# EAGLE design usb2ax_v4.0 (EAGLE 7.2.0)
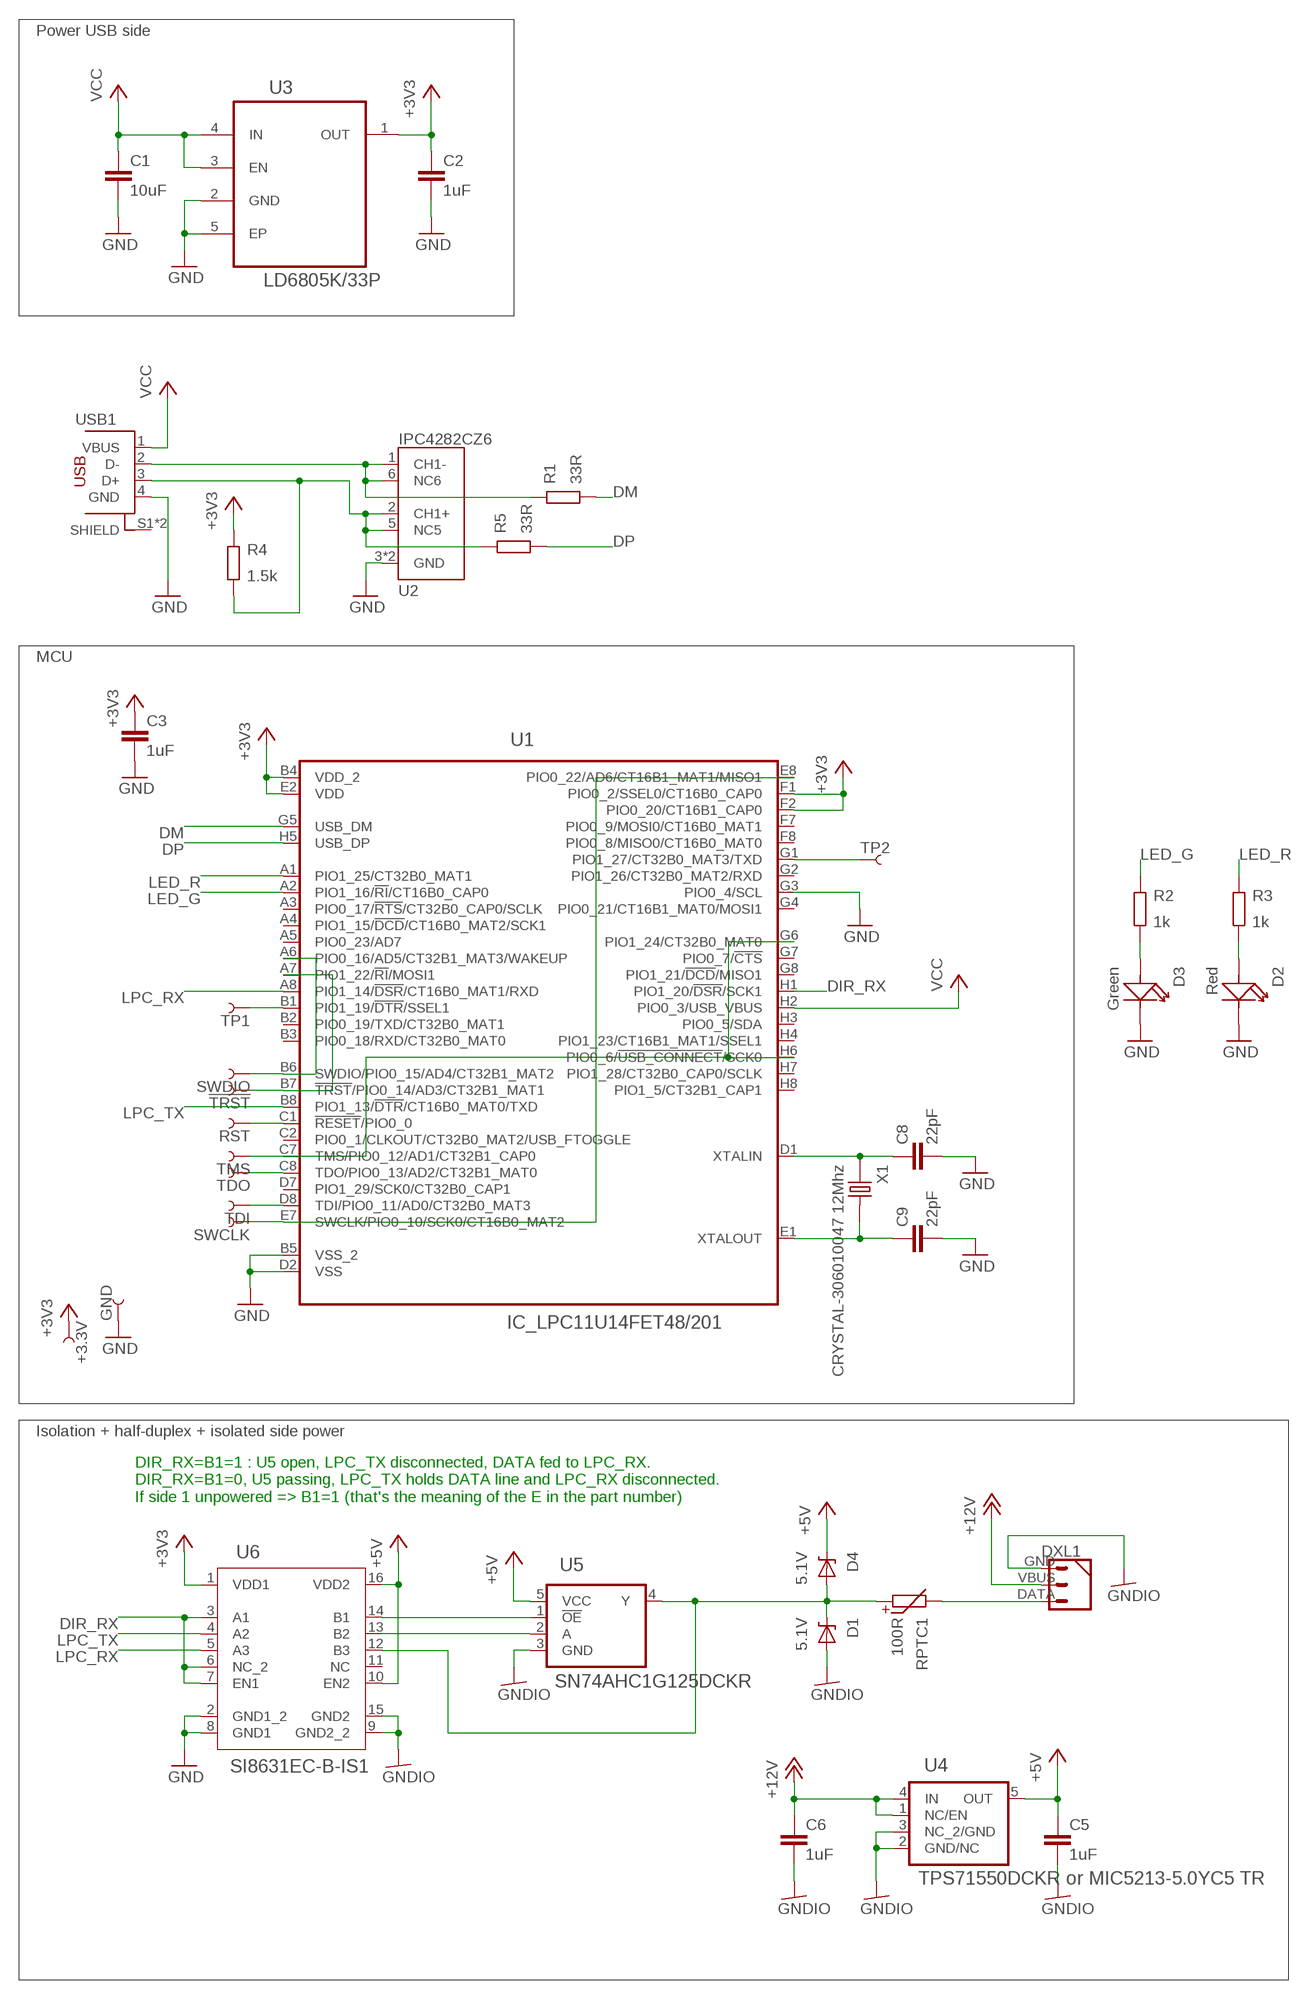
[diagram p0: schematic, sheet 1]

## Parts
!TRST  PIN_SMD_1X1  [PIN_SMD_1X1]
+3.3V  PIN_SMD_1X1  [PIN_SMD_1X1]
C1  10uF  C0805_L  [0805_L]
C2  1uF  C0402  [0402_N]
C3  1uF  C0402  [0402_N]
C5  1uF  C0402  [0402_N]
C6  1uF  C0402  [0402_N]
C8  22pF  C0402  [0402_N]
C9  22pF  C0402  [0402_N]
D1  5.1V  DIODE_ZENER-923  [SOD-923_N]
D2  Red  LED  [LED0603]
D3  Green  LED  [LED0603]
D4  5.1V  DIODE_ZENER-923  [SOD-923_N]
DXL1  DYNAMIXEL_3POS-R  [DYNAMIXEL_3POS_RIGHT]
GND  PIN_SMD_1X1  [PIN_SMD_1X1]
R1  33R  R0201  [0201_N]
R2  1k  R0201  [0201_N]
R3  1k  R0201  [0201_N]
R4  1.5k  R0201  [0201_N]
R5  33R  R0201  [0201_N]
RPTC1  100R  R-PTC0603  [0603_N]
RST  PIN_SMD_1X1  [PIN_SMD_1X1]
SWCLK  PIN_SMD_1X1  [PIN_SMD_1X1]
SWDIO  PIN_SMD_1X1  [PIN_SMD_1X1]
TDI  PIN_SMD_1X1  [PIN_SMD_1X1]
TDO  PIN_SMD_1X1  [PIN_SMD_1X1]
TMS  PIN_SMD_1X1  [PIN_SMD_1X1]
TP1  PIN_SMD_1X1  [PIN_SMD_1X1]
TP2  PIN_SMD_1X1  [PIN_SMD_1X1]
U1  IC_LPC11U14FET48/201  [BGA48C50P8X8_460X460X110]
U2  IPC4282CZ6  [XSON6_N]
U3  LD6805K/33P  [NXP_LD6805]
U4  TPS71550DCKR or MIC5213-5.0YC5 TR  TPS71550DCKR  [SOT65P210X110-5N]
U5  SN74AHC1G125DCKR  [SOT65P210X110-5N]
U6  SI8631EC-B-IS1  SI8631BC-B-IS1  [SOIC-16]
USB1  USB-STANDARD-PLUG_A_THT  [USB-A-THT]
X1  CRYSTAL-306010047 12Mhz  CRYSTAL-0500290P1  [2P-SMD-5.0X3.2]

## Nets
!TRST: !TRST.P$1 U1.A7(PIO1_22/!RI!/MOSI1) U1.B7(!TRST!/PIO0_14/AD3/CT32B1_MAT1)
+3V3: +3.3V.P$1 C2.1 C3.1 R4.2 U1.B4(VDD_2) U1.E2(VDD) U1.F1(PIO0_2/SSEL0/CT16B0_CAP0) U1.F2(PIO0_20/CT16B1_CAP0) U3.1(OUT) U6.1(VDD1)
+5V: C5.1 D4.C U4.5(OUT) U5.5(VCC) U6.10(EN2) U6.16(VDD2)
+12V: C6.1 DXL1.VBUS U4.1(NC/EN) U4.4(IN)
DIR_RX: U1.H1(PIO1_20/!DSR!/SCK1) U6.3(A1) U6.6(NC_2) U6.7(EN1)
DM: R1.1 U1.G5(USB_DM)
DP: R5.1 U1.H5(USB_DP)
GND: C1.2 C2.2 C3.2 C8.2 C9.2 D2.- D3.- GND.P$1 U1.B5(VSS_2) U1.D2(VSS) U1.G3(PIO0_4/SCL) U2.3(GND) U2.4(GND) U3.2(GND) U3.5(EP) U6.2(GND1_2) U6.8(GND1) USB1.4(GND)
GNDIO: C5.2 C6.2 D1.A DXL1.GND U4.2(GND/NC) U4.3(NC_2/GND) U5.3(GND) U6.9(GND2_2) U6.15(GND2)
LED_G: R2.2 U1.A2(PIO1_16/!RI!/CT16B0_CAP0)
LED_R: R3.2 U1.A1(PIO1_25/CT32B0_MAT1)
LPC_RX: U1.A8(PIO1_14/!DSR!/CT16B0_MAT1/RXD) U6.5(A3)
LPC_TX: U1.B8(PIO1_13/!DTR!/CT16B0_MAT0/TXD) U6.4(A2)
N$1: TP1.P$1 U1.B1(PIO1_19/!DTR!/SSEL1)
N$2: D3.+ R2.1
N$3: U5.2(A) U6.13(B2)
N$4: D1.C D4.A RPTC1.1 U5.4(Y) U6.12(B3)
N$5: TP2.P$1 U1.G1(PIO1_27/CT32B0_MAT3/TXD)
N$6: DXL1.DATA RPTC1.2
N$7: C9.1 U1.E1(XTALOUT) X1.2
N$8: C8.1 U1.D1(XTALIN) X1.1
N$9: D2.+ R3.1
N$11: R1.2 U2.1(CH1-) U2.6(NC6) USB1.2(D-)
N$12: R4.1 R5.2 U2.2(CH1+) U2.5(NC5) USB1.3(D+)
N$24: U5.1(!OE) U6.14(B1)
RST: RST.P$1 U1.C1(!RESET!/PIO0_0)
SWCLK: SWCLK.P$1 U1.E7(SWCLK/PIO0_10/SCK0/CT16B0_MAT2) U1.E8(PIO0_22/AD6/CT16B1_MAT1/MISO1)
SWDIO: SWDIO.P$1 U1.A6(PIO0_16/AD5/CT32B1_MAT3/WAKEUP) U1.B6(SWDIO/PIO0_15/AD4/CT32B1_MAT2)
TDI: TDI.P$1 U1.D8(TDI/PIO0_11/AD0/CT32B0_MAT3)
TDO: TDO.P$1 U1.C8(TDO/PIO0_13/AD2/CT32B1_MAT0)
TMS: TMS.P$1 U1.C7(TMS/PIO0_12/AD1/CT32B1_CAP0) U1.G6(PIO1_24/CT32B0_MAT0) U1.H6(PIO0_6/!USB_CONNECT!/SCK0)
VCC: C1.1 U1.H2(PIO0_3/USB_VBUS) U3.3(EN) U3.4(IN) USB1.1(VBUS)
Unconnected: U1.A3(PIO0_17/!RTS!/CT32B0_CAP0/SCLK) U1.A4(PIO1_15/!DCD!/CT16B0_MAT2/SCK1) U1.A5(PIO0_23/AD7) U1.B2(PIO0_19/TXD/CT32B0_MAT1) U1.B3(PIO0_18/RXD/CT32B0_MAT0) U1.C2(PIO0_1/CLKOUT/CT32B0_MAT2/USB_FTOGGLE) U1.D7(PIO1_29/SCK0/CT32B0_CAP1) U1.F7(PIO0_9/MOSI0/CT16B0_MAT1) U1.F8(PIO0_8/MISO0/CT16B0_MAT0) U1.G2(PIO1_26/CT32B0_MAT2/RXD) U1.G4(PIO0_21/CT16B1_MAT0/MOSI1) U1.G7(PIO0_7/!CTS!) U1.G8(PIO1_21/!DCD!/MISO1) U1.H3(PIO0_5/SDA) U1.H4(PIO1_23/CT16B1_MAT1/SSEL1) U1.H7(PIO1_28/CT32B0_CAP0/SCLK) U1.H8(PIO1_5/CT32B1_CAP1) U6.11(NC) USB1.S1(SHIELD) USB1.S2(SHIELD)

## Notes on the sheet
- Power USB side
- MCU
- Isolation + half-duplex + isolated side power
- DIR_RX=B1=1 : U5 open, LPC_TX disconnected, DATA fed to LPC_RX.
  DIR_RX=B1=0, U5 passing, LPC_TX holds DATA line and LPC_RX disconnected.
  If side 1 unpowered => B1=1 (that's the meaning of the E in the part number)

## Library data of the parts
!TRST +3.3V GND RST SWCLK SWDIO TDI TDO TMS TP1 TP2 = Xevelabs:PIN
C1-C3 C5 C6 C8 C9 = Xevelabs:C: Non-polarized Capacitor
D1 D4 = Xevelabs:DIODE_ZENER: Zener Diode
D2 D3 = OPL:LED*: LED
DXL1 = Xevelabs:DYNAMIXEL_3POS
R1-R5 = Xevelabs:R: Resistor
RPTC1 = Xevelabs:R-PTC: PTC (Positive Temperature Coefficient) Resistor
U1 = Xevelabs:IC_LPC11U14FET48/201: 32-bit ARM Cortex-M0 microcontroller,BGA- 48; MPN: LPC11U14FET48/201; OC_FARNELL: 1972556; OC_NEWARK: unknown; PACKAGE: BGA- 48; SUPPLIER: NXP
U2 = Xevelabs:IPC4282CZ6: IPC4282CZ6 ESD suppressor from NXP
U3 = NXP-LD6805K:LD6805K/: Low-dropout regulators, high PSRR, 150 mA, DFN1010C-4; MPN: LD6805K/33P; OC_FARNELL: 2095530; OC_NEWARK: 93T1648; PACKAGE: DFN1010C-4; SUPPLIER: NXP
U4 = TI-TPS71550DCKR:TPS71550DCKR: Linear Regulator; MPN: TPS71550DCKR; OC_FARNELL: 1652373; OC_NEWARK: 34H2504; PACKAGE: SC-70-5; SUPPLIER: Texas Instruments
U5 = TI-TPS71550DCKR:SN74AHC1G125DCKR: Single Bus Buffer Gate With 3-State Output; MPN: SN74AHC1G126DCKR; PACKAGE: SC70-5; SUPPLIER: Texas Instruments
U6 = TI-TPS71550DCKR:SI8631BC-B-IS1
USB1 = Xevelabs:USB-STANDARD: USB (4 pins) connectors, plugs and receptacles.
X1 = OPL:CRYSTAL*

## Board
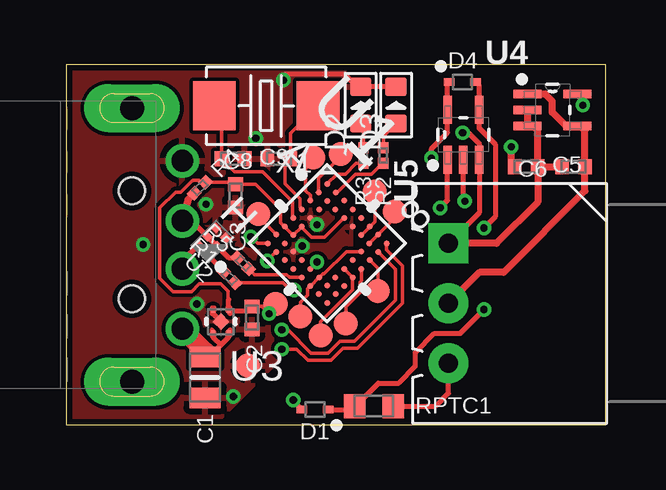
[diagram p1: board, top side]
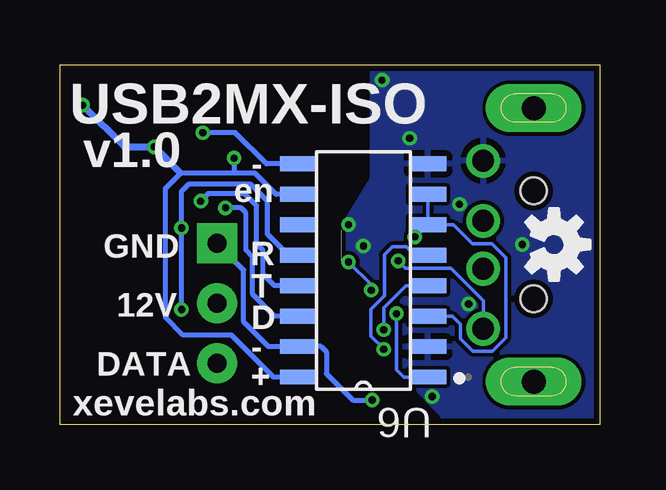
[diagram p2: board, bottom side, seen from below]

Size 22.5 x 15 mm. Coordinates in mm from the lower left corner, seen from the top.
Outline: 0,15 0,0 22.5,0 22.5,15 0,15
Copper layers (1*16): Top 0.035mm / dielectric 1.5mm / Bottom 0.035mm
Design rules "SeeedStudio_2layer_DRU_no_angle_20140221_mm *": minimum track width 0.15mm, minimum drill 0.3mm, track to track 0.155mm, track to pad 0.155mm, pad to pad 0.155mm, via to via 0.155mm, smd to smd 0mil, copper to edge 0.25mm, drill to drill 0.25mm, minimum pad ring 0.25mm, minimum via ring 0.15mm, stop-mask expansion 0.05mm, vias tented up to drill 100mil, thermal gap 0.25mm

### Footprints (pad centres in the part's own frame; a part is rotated, then mirrored left to right if it is on the bottom)
PIN_SMD_1X1 = smd 1 x 1: P$1 0,0
0805_L = smd 0.85 x 1.3: 1 -0.85,0; 2 0.85,0
0402_N = smd 0.57 x 0.62: 1 -0.48,0; 2 0.48,0
SOD-923_N = smd 0.43 x 0.32: A 0.55,0; C -0.55,0
LED0603 = smd 0.762 x 0.889: + -0.762,0; - 0.762,0
DYNAMIXEL_3POS_RIGHT = drill 0.8 pad 1.676: DATA 0,-5; VBUS 0,-2.5 | drill 0.8 pad 1.676 square: GND 0,0
0201_N = smd 0.46 x 0.42: 1 -0.33,0; 2 0.33,0
0603_N = smd 0.9 x 1: 1 -0.8,0; 2 0.8,0
BGA48C50P8X8_460X460X110 = smd 0.254 x 0.254: A1 -1.753,1.753; A2 -1.245,1.753; A3 -0.762,1.753; A4 -0.254,1.753; A5 0.254,1.753; A6 0.762,1.753; A7 1.245,1.753; A8 1.753,1.753; B1 -1.753,1.245; B2 -1.245,1.245; B3 -0.762,1.245; B4 -0.254,1.245; B5 0.254,1.245; B6 0.762,1.245; B7 1.245,1.245; B8 1.753,1.245; C1 -1.753,0.762; C2 -1.245,0.762; C7 1.245,0.762; C8 1.753,0.762; D1 -1.753,0.254; D2 -1.245,0.254; D7 1.245,0.254; D8 1.753,0.254; E1 -1.753,-0.254; E2 -1.245,-0.254; E7 1.245,-0.254; E8 1.753,-0.254; F1 -1.753,-0.762; F2 -1.245,-0.762; F7 1.245,-0.762; F8 1.753,-0.762; G1 -1.753,-1.245; G2 -1.245,-1.245; G3 -0.762,-1.245; G4 -0.254,-1.245; G5 0.254,-1.245; G6 0.762,-1.245; G7 1.245,-1.245; G8 1.753,-1.245; H1 -1.753,-1.753; H2 -1.245,-1.753; H3 -0.762,-1.753; H4 -0.254,-1.753; H5 0.254,-1.753; H6 0.762,-1.753; H7 1.245,-1.753; H8 1.753,-1.753
XSON6_N = smd 0.35 x 0.3: 1 -0.3,0.5; 2 -0.3,0; 3 -0.3,-0.5; 4 0.3,-0.5; 5 0.3,0; 6 0.3,0.5
NXP_LD6805 = smd 0.17 x 0.17: 1 -0.325,-0.45; 2 0.325,-0.45; 3 0.325,0.45; 4 -0.325,0.45 | smd 0.48 x 0.48 rotated 45: 5 0,0
SOT65P210X110-5N = smd 1.168 x 0.356: 1 -1.041,0.66; 2 -1.041,0; 3 -1.041,-0.66; 4 1.041,-0.66; 5 1.041,0.66
SOIC-16 = smd 1.549 x 0.61: 1 -2.7,4.445; 2 -2.7,3.175; 3 -2.7,1.905; 4 -2.7,0.635; 5 -2.7,-0.635; 6 -2.7,-1.905; 7 -2.7,-3.175; 8 -2.7,-4.445; 9 2.7,-4.445; 10 2.7,-3.175; 11 2.7,-1.905; 12 2.7,-0.635; 13 2.7,0.635; 14 2.7,1.905; 15 2.7,3.175; 16 2.7,4.445
USB-A-THT = drill 0.9: 1 2.1,-3.5; 2 2.1,-1; 3 2.1,1; 4 2.1,3.5 | drill 1 pad 2 long: S1 0,5.7; S2 0,-5.7 | hole 1.1: 0,-2.25; 0,2.25
2P-SMD-5.0X3.2 = smd 1.778 x 2.032: 1 -2.159,0; 2 2.159,0

### Placement (x,y rotation side)
!TRST  13.7,8.89 0 top
+3.3V  8.74,5.04 90 top
C1  5.8,1.98 270 top
C2  7.76,4.46 270 top
C3  7.07,9.54 270 top
C5  19.19,10.76 0 top
C6  21.16,10.76 180 top
C8  8.88,11.09 180 top
C9  6.97,11.09 0 top
D1  10.38,0.64 180 top
D2  12.29,13.32 90 top
D3  13.77,13.32 90 top
D4  16.53,14.29 0 top
DXL1  15.95,7.56 0 top
GND  7.58,2.46 90 top
R1  6.81,6.15 135 top
R2  13.23,11.22 270 top
R3  12.41,11.22 270 top
R4  5.58,9.88 45 top
R5  7.39,6.73 135 top
RPTC1  12.84,0.78 0 top
RST  10.31,11.13 270 top
SWCLK  10.62,3.72 0 top
SWDIO  12.88,9.71 0 top
TDI  11.67,4.22 0 top
TDO  13,5.57 0 top
TMS  9.78,4.52 0 top
TP1  11.46,11.29 0 top
TP2  8.03,8.79 0 top
U1  10.89,7.56 315 top
U2  6.1,7.64 135 top
U3  6.46,4.3 180 top
U4  20.29,13.12 0 top
U5  16.57,12.08 90 top
U6  9.85,6.43 180 bottom
U$1  [OSHW-LOGO-S]  1.9,7.51 270 bottom
USB1  2.75,7.5 0 top
X1  8.35,13.29 180 top

### Tracks (layer width: path | path; a pad name or v marks a point on that pad's centre or on a via)
!TRST
  Top 0.15: U1.B7 U1.A7 13.7,8.61 !TRST.P$1
+3V3  (via drill 0.3)
  Top 0.15: 6.79,5.22 6.77,5.24 6.77,5.56 6.45,5.88 5.56,5.88 5.23,5.55 4.47,5.55 3.91,6.11 3.91,9.04 4.57,9.7 4.78,9.7 5.23,10.15 5.28,10.17 5.31,10.19 5.55,10.19 5.63,10.11 R4.2 6.98,10.11 C3.1 7.91,10.02 8.95,8.98 8.95,8.43 U1.F1 U1.F2 | U1.B4 10.79,7.81 10.24,7.81 9.84,8.21 U1.E2 U1.F2 | U1.F2 | +3.3V.P$1 8.47,4.77 v8.47,4.63 8.16,4.93 | C2.1 8.16,4.93 | 8.16,4.93 8.23,4.93 8.31,5.01
  Top 0.2: C2.1 7.58,4.75 U3.1 6.79,5.22
  Bottom 0.15: U6.1 8.15,1.99 8.47,2.3 v8.47,4.63
+5V  (via drill 0.3)
  Top 0.2: 15.91,12.68 U5.5 | v15.24,11.11 15.24,11.5 15.91,12.17 U5.5 | U5.5 | U5.5 15.91,14.22 D4.C
  Top 0.3: C5.1 18.57,10.9 v18.57,11.58 | U4.5 21.55,13.56 v21.55,13.32
  Bottom 0.2: U6.16 13.6,1.99 15.35,3.74 17.36,3.74 18.1,4.48 18.1,9.86 17.47,10.49 15.21,10.49 | U6.10 13.48,9.61 14.37,10.49 15.21,10.49 | v15.24,11.11 15.24,10.52 15.21,10.49
  Bottom 0.3: 17.47,10.49 v18.56,11.58 v18.57,11.58 19.81,11.58 v21.55,13.32
+12V
  Top 0.2: U4.1
  Top 0.3: U4.1 19.99,13.78 20.28,13.49 20.28,13.02 20.84,12.46 U4.4 21.44,12.46 21.64,12.26 C6.1 21.64,9.74 18.25,6.35 17.24,6.35 DXL1.VBUS
DIR_RX  (via drill 0.3)
  Top 0.15: v7.71,7.83 7.98,7.56 U1.H1
  Bottom 0.15: U6.3 6.14,4.52 5.81,4.19 5.81,3.59 5.29,3.07 4.46,3.07 3.91,3.62 3.91,6.97 4.49,7.55 5.31,7.55 6.09,8.34 U6.6 | U6.7 U6.6 | U6.6 7.66,7.83 v7.71,7.83
DM  (via drill 0.3)
  Top 0.15: R1.1 9.05,5.92 9.36,5.61 v9.52,5.61 | v10.47,6.78 U1.G5
  Bottom 0.15: v9.52,5.61 9.52,5.83 v10.47,6.78
DP
  Top 0.15: U1.H5 9.32,6.14 9.2,6.26 7.86,6.26 R5.1
GND  (via drill 0.3)
  Top 0.15: 10.2,8.63 U1.D2 v10.47,8.34 | U1.G3 9.71,7.45 v9.85,7.45 | D2.- 12.14,14.08 | 9.15,14.61 8.96,14.42
  Top 0.2: U3.2 6.13,4.62 U3.5 | D3.- D2.- | 12.14,14.08 11.61,14.61 9.15,14.61
  other vias: 7.92,11.94 5.84,9.19 3.22,7.51 5.46,5.03 6.98,1.18 9.07,14.36
  pour Bottom: -0.99,16.05 9.5,15.25 9.5,10.26 10.5,8.62 10.5,4.5 5.92,-0.26 5.34,-1.04 -1.11,-0.93
  pour Top: -0.54,15.6 -0.34,-0.64 5.81,-0.33 11.89,5.75 11.89,15.75
GNDIO  (via drill 0.3)
  Top 0.2: D1.A 9.48,0.99 v9.48,1.03 | DXL1.GND 17.23,8.84 U5.3 17.23,11.72 16.78,12.17 v16.54,12.17
  Top 0.3: C5.2 C6.2 | U4.2 U4.3 19.47,12.46 19.67,12.26 C5.2 | DXL1.GND 17.95,7.56 19.67,9.28 C5.2
  Bottom 0.2: v9.48,1.03 10.29,1.03 11.39,2.13 11.39,3.04 11.62,3.27 12.54,3.27 U6.15 13.8,3.25 14.84,4.29 14.84,6.45 DXL1.GND | U6.9 13.89,10.88 15.19,12.17 v16.54,12.17
LED_G
  Top 0.15: R2.2 13.2,10.89 12.74,10.43 12.08,10.43 11.33,9.68 U1.A2
LED_R
  Top 0.15: R3.2 12.1,10.89 11.65,10.44 11.3,10.44 U1.A1
LPC_RX  (via drill 0.3)
  Top 0.15: v9,3.15 9.62,3.15 10.09,2.68 11.06,2.68 11.56,3.18 12.16,3.18 14.04,5.06 14.04,6.62 13.37,7.29 U1.A8
  Bottom 0.15: U6.5 7.71,7.07 8.06,7.41 8.64,7.41 8.97,7.08 8.97,5.37 9.53,4.81 9.53,3.69 v9,3.16 v9,3.15
LPC_TX  (via drill 0.3)
  Top 0.15: U1.B8 13.73,6.49 13.73,5.19 12.03,3.49 11.43,3.49 10.93,2.99 10.22,2.99 9.25,3.96 v9,3.96
  Bottom 0.15: U6.4 8.07,5.79 9,4.87 v9,3.96
N$1
  Top 0.15: U1.B1 10.54,10.27 11.4,11.13 11.4,11.23 TP1.P$1
N$2
  Top 0.15: R2.1 13.23,12.02 D3.+
N$3  (via drill 0.3)
  Top 0.2: v16.63,9.32 16.57,9.38 U5.2
  Bottom 0.2: U6.13 13.55,5.79 14.04,6.28 14.04,7.28 14.3,7.54 14.3,9.13 14.8,9.63 16.32,9.63 v16.63,9.32
N$4  (via drill 0.3)
  Top 0.2: D1.C 11.89,0.64 RPTC1.1 12.07,0.78 13.03,1.74 13.88,1.74 14.57,2.43 14.57,3.01 15.37,3.81 16.44,3.81 v17.43,4.8 | U5.4 17.23,14.14 D4.A | U5.4 17.23,12.35 17.92,11.66 17.92,8.69 v17.43,8.2 | U5.4
  Bottom 0.2: U6.12 12.96,7.06 13.85,7.95 13.85,9.32 14.55,10.02 17.14,10.02 17.43,9.73 v17.43,8.2 v17.43,4.8
N$5
  Top 0.15: U1.G1 8.03,8.66 TP2.P$1
N$6
  Top 0.2: RPTC1.2 15.42,0.78 15.95,1.31 DXL1.DATA
N$7
  Top 0.15: X1.2 6.49,13.29 C9.1 7.04,10.54 8.2,10.54 9.45,9.29 9.45,8.65 U1.E1
N$8
  Top 0.15: X1.1 9.36,12.14 C8.1 | 9.36,10.99 C8.1 | U1.D1 9.76,9.05 9.76,9.42 9.14,10.04 9.14,10.87 C8.1
N$9
  Top 0.15: R3.1 12.41,12.44 D2.+
N$11
  Top 0.2: USB1.2 4.85,6.82 U2.6 U2.1 5.96,7 R1.2
N$12
  Top 0.15: R4.1
  Top 0.2: USB1.3 5.25,8.5 U2.5 U2.2 6.78,6.96 R5.2
  Top 0.3: R4.1 5.09,9.39 USB1.3
N$24  (via drill 0.3)
  Top 0.2: v15.6,9.04 15.91,9.35 U5.1
  Bottom 0.2: U6.14 13.55,4.53 14.46,5.43 14.46,7.01 14.74,7.29 14.74,8.83 14.95,9.04 v15.6,9.04
RST
  Top 0.15: U1.C1 10.2,9.55 9.99,9.76 9.99,10.66 10.31,10.98 RST.P$1
SWCLK
  Top 0.15: SWCLK.P$1 10.62,4.3 11.96,5.63 U1.E8 U1.E7
SWDIO
  Top 0.15: U1.B6 U1.A6 12.88,8.47 SWDIO.P$1
TDI
  Top 0.15: TDI.P$1 11.67,4.91 12.26,5.5 12.26,5.94 12.31,5.99 U1.D8
TDO
  Top 0.15: U1.C8 13,6.53 TDO.P$1
TMS
  Top 0.15: U1.C7 11.69,7.22 10.77,6.3 10.71,6.3 U1.G6 U1.H6 10.08,5.67 10.08,5.4 9.78,5.1 TMS.P$1
VCC  (via drill 0.3)
  Top 0.15: 5.96,2.83 C1.1 | v8.4,6.83 U1.H2
  Top 0.2: U3.4 6.79,3.65 6.46,3.33 | 6.46,3.33 5.96,2.83 | U3.3 6.13,3.65 6.46,3.33
  Top 0.8: C1.1 5.8,3.04 USB1.1
  Bottom 0.15: v8.4,6.83 8.09,6.52 6.2,6.52 4.85,5.17 USB1.1

### Text on the board
bPlace: USB2MX-ISO | v1.0 | - | en | GND | R | 12V | T | D | - | DATA | + | xevelabs.com